# Altium schematic sheet LSM6DSOX_Ctrl.SchDoc
size A4
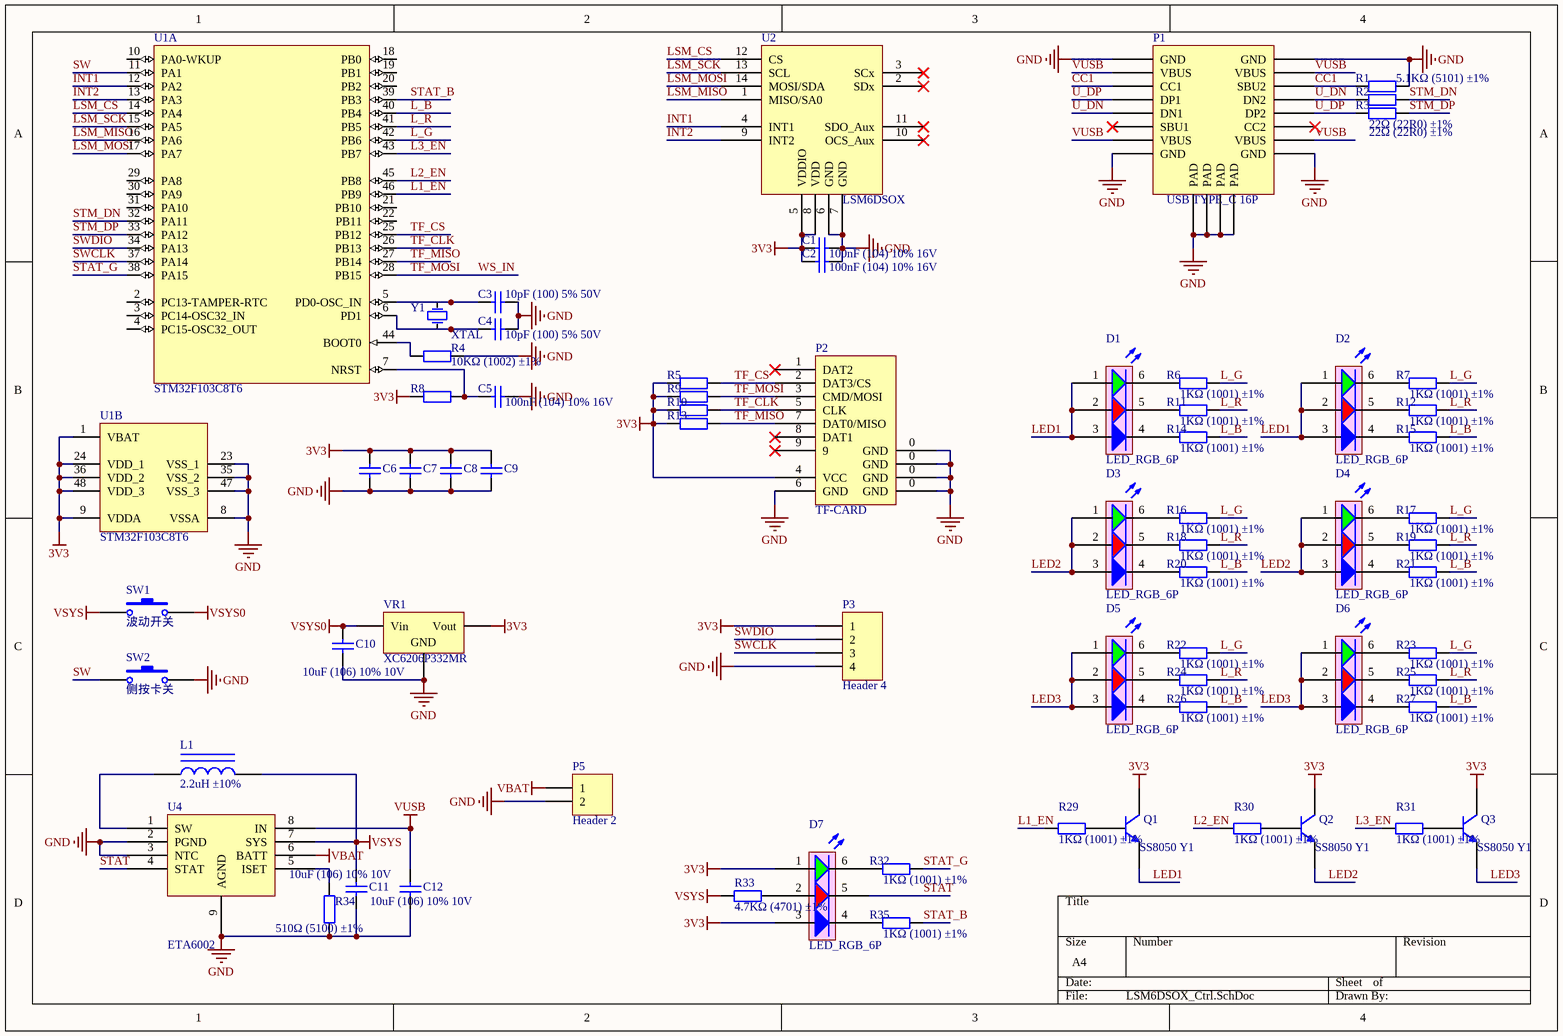
[diagram p0: LSM6DSOX_Ctrl.SchDoc]

## Parts
C1  100nF (104) 10% 16V  [0402_C]
C2  100nF (104) 10% 16V  [0402_C]
C3  10pF (100) 5% 50V  [0402_C]
C4  10pF (100) 5% 50V  [0402_C]
C5  100nF (104) 10% 16V  [0402_C]
C6  100nF (104) 10% 16V  [0402_C]  (value not drawn)
C7  100nF (104) 10% 16V  [0402_C]  (value not drawn)
C8  100nF (104) 10% 16V  [0402_C]  (value not drawn)
C9  100nF (104) 10% 16V  [0402_C]  (value not drawn)
C10  10uF (106) 10% 10V  [0603_C]
C11  10uF (106) 10% 10V  [0603_C]
C12  10uF (106) 10% 10V  [0603_C]
D1  LED_RGB_6P  [LED_6P]
D2  LED_RGB_6P  [LED_6P]
D3  LED_RGB_6P  [LED_6P]
D4  LED_RGB_6P  [LED_6P]
D5  LED_RGB_6P  [LED_6P]
D6  LED_RGB_6P  [LED_6P]
D7  LED_RGB_6P  [LED_6P]
L1  2.2uH ±10%  [0805_L]
P1  USB TYPE_C 16P  [USB-Typec 16P母]
P2  TF-CARD  [TF-1.7H]
P3  Header 4  [HDR1X4]
P5  Header 2  [HDR1X2]
Q1  SS8050 Y1  [SOT-23(SOT-23-3)]
Q2  SS8050 Y1  [SOT-23(SOT-23-3)]
Q3  SS8050 Y1  [SOT-23(SOT-23-3)]
R1  5.1KΩ (5101) ±1%  [0402_R]
R2  22Ω (22R0) ±1%  [0402_R]
R3  22Ω (22R0) ±1%  [0402_R]
R4  10KΩ (1002) ±1%  [0402_R]
R5  10KΩ (1002) ±1%  [0402_R]  (value not drawn)
R6  1KΩ (1001) ±1%  [0402_R]
R7  1KΩ (1001) ±1%  [0402_R]
R8  10KΩ (1002) ±1%  [0402_R]  (value not drawn)
R9  10KΩ (1002) ±1%  [0402_R]  (value not drawn)
R10  10KΩ (1002) ±1%  [0402_R]  (value not drawn)
R11  1KΩ (1001) ±1%  [0402_R]
R12  1KΩ (1001) ±1%  [0402_R]
R13  10KΩ (1002) ±1%  [0402_R]  (value not drawn)
R14  1KΩ (1001) ±1%  [0402_R]
R15  1KΩ (1001) ±1%  [0402_R]
R16  1KΩ (1001) ±1%  [0402_R]
R17  1KΩ (1001) ±1%  [0402_R]
R18  1KΩ (1001) ±1%  [0402_R]
R19  1KΩ (1001) ±1%  [0402_R]
R20  1KΩ (1001) ±1%  [0402_R]
R21  1KΩ (1001) ±1%  [0402_R]
R22  1KΩ (1001) ±1%  [0402_R]
R23  1KΩ (1001) ±1%  [0402_R]
R24  1KΩ (1001) ±1%  [0402_R]
R25  1KΩ (1001) ±1%  [0402_R]
R26  1KΩ (1001) ±1%  [0402_R]
R27  1KΩ (1001) ±1%  [0402_R]
R29  1KΩ (1001) ±1%  [0402_R]
R30  1KΩ (1001) ±1%  [0402_R]
R31  1KΩ (1001) ±1%  [0402_R]
R32  1KΩ (1001) ±1%  [0402_R]
R33  4.7KΩ (4701) ±1%  [0402_R]
R34  510Ω (5100) ±1%  [0603_R]
R35  1KΩ (1001) ±1%  [0402_R]
SW1  波动开关  [SW-SMD_3P-L6.6-W2.7-P1.50]
SW2  侧按卡关  [SW_PTCFG]
U1  STM32F103C8T6  [LQFP-48_7x7x05P]  (parts A,B of 2)
U2  LSM6DSOX  [LGA-14L]
U4  ETA6002  [SOIC-8P]
VR1  XC6206P332MR  [SOT-23-3L]
Y1  XTAL  [MURATA]

## Nets
3V3: C1.1 C2.1 C6.2 C7.2 C8.2 C9.2 D7.1(A_G) D7.3(A_R) P2.4(VCC) P3.1 Q1.3(C) Q2.3(C) Q3.3(C) R5.1 R8.1 R9.1 R10.1 R13.1 U1.1(VBAT) U1.9(VDDA) U1.24(VDD_1) U1.36(VDD_2) U1.48(VDD_3) U2.5(VDDIO) U2.8(VDD) VR1.2(Vout)
GND: C1.2 C2.2 C3.2 C4.1 C5.2 C6.1 C7.1 C8.1 C9.1 C10.1 C11.1 C12.1 P1.1(PAD) P1.2(PAD) P1.3(PAD) P1.4(PAD) P1.A1(GND) P1.A12(GND) P1.B1(GND) P1.B12(GND) P2.0(GND) P2.6(GND) P3.4 P5.2 R1.2 R4.2 R34.1 SW2.2 U1.8(VSSA) U1.23(VSS_1) U1.35(VSS_2) U1.47(VSS_3) U2.6(GND) U2.7(GND) U4.2(PGND) U4.3(NTC) U4.9(AGND) VR1.1(GND)
VBAT: P5.1 U4.6(BATT)
VSYS: C11.2 L1.2 R33.1 SW1.1 U4.7(SYS)
VSYS0: C10.2 SW1.2 VR1.3(Vin)
VUSB: C12.2 P1.A4(VBUS) P1.A9(VBUS) P1.B4(VBUS) P1.B9(VBUS) U4.8(IN)
CC1: P1.A5(CC1) P1.B8(SBU2) R1.1
INT1: U1.12(PA2) U2.4(INT1)
INT2: U1.13(PA3) U2.9(INT2)
L1_EN: R29.1 U1.46(PB9)
L2_EN: R30.1 U1.45(PB8)
L3_EN: R31.1 U1.43(PB7)
L_B: R14.2 R15.2 R20.2 R21.2 R26.2 R27.2 U1.40(PB4)
L_G: R6.2 R7.2 R16.2 R17.2 R22.2 R23.2 U1.42(PB6)
L_R: R11.2 R12.2 R18.2 R19.2 R24.2 R25.2 U1.41(PB5)
LED1: D1.1(A_G) D1.2(A_B) D1.3(A_R) D2.1(A_G) D2.2(A_B) D2.3(A_R) Q1.2(E)
LED2: D3.1(A_G) D3.2(A_B) D3.3(A_R) D4.1(A_G) D4.2(A_B) D4.3(A_R) Q2.2(E)
LED3: D5.1(A_G) D5.2(A_B) D5.3(A_R) D6.1(A_G) D6.2(A_B) D6.3(A_R) Q3.2(E)
LSM_CS: U1.14(PA4) U2.12(CS)
LSM_MISO: U1.16(PA6) U2.1(MISO/SA0)
LSM_MOSI: U1.17(PA7) U2.14(MOSI/SDA)
LSM_SCK: U1.15(PA5) U2.13(SCL)
STAT: D7.5(B) U4.4(STAT)
STAT_B: R35.2 U1.39(PB3)
STAT_G: R32.2 U1.38(PA15)
STM_DN: R2.2 U1.32(PA11)
STM_DP: R3.2 U1.33(PA12)
SW: SW2.1 U1.11(PA1)
SWCLK: P3.3 U1.37(PA14)
SWDIO: P3.2 U1.34(PA13)
TF_CLK: P2.5(CLK) R10.2 U1.26(PB13)
TF_CS: P2.2(DAT3/CS) R5.2 U1.25(PB12)
TF_MISO: P2.7(DAT0/MISO) R13.2 U1.27(PB14)
TF_MOSI: P2.3(CMD/MOSI) R9.2 U1.28(PB15)  [also labelled WS_IN]
U_DN: P1.A7(DN1) P1.B7(DN2) R2.1
U_DP: P1.A6(DP1) P1.B6(DP2) R3.1
NetC3_1: C3.1 U1.5(PD0-OSC_IN) Y1.2(OSC2)
NetC4_2: C4.2 U1.6(PD1) Y1.1(OSC1)
NetC5_1: C5.1 R8.2 U1.7(NRST)
NetD1_4: D1.4(R) R14.1
NetD1_5: D1.5(B) R11.1
NetD1_6: D1.6(G) R6.1
NetD2_4: D2.4(R) R15.1
NetD2_5: D2.5(B) R12.1
NetD2_6: D2.6(G) R7.1
NetD3_4: D3.4(R) R20.1
NetD3_5: D3.5(B) R18.1
NetD3_6: D3.6(G) R16.1
NetD4_4: D4.4(R) R21.1
NetD4_5: D4.5(B) R19.1
NetD4_6: D4.6(G) R17.1
NetD5_4: D5.4(R) R26.1
NetD5_5: D5.5(B) R24.1
NetD5_6: D5.6(G) R22.1
NetD6_4: D6.4(R) R27.1
NetD6_5: D6.5(B) R25.1
NetD6_6: D6.6(G) R23.1
NetD7_2: D7.2(A_B) R33.2
NetD7_4: D7.4(R) R35.1
NetD7_6: D7.6(G) R32.1
NetL1_1: L1.1 U4.1(SW)
NetQ1_1: Q1.1(B) R29.2
NetQ2_1: Q2.1(B) R30.2
NetQ3_1: Q3.1(B) R31.2
NetR4_1: R4.1 U1.44(BOOT0)
NetR34_2: R34.2 U4.5(ISET)

Not connected (* = marked no-connect by the designer): P1 A8(SBU1)* B5(CC2)*; P2 1(DAT2)* 8(DAT1)* 9*; U1 2(PC13-TAMPER-RTC) 3(PC14-OSC32_IN) 4(PC15-OSC32_OUT) 10(PA0-WKUP) 18(PB0) 19(PB1) 20(PB2) 21(PB10) 22(PB11) 29(PA8) 30(PA9) 31(PA10); U2 2(SDx)* 3(SCx)* 10(OCS_Aux)* 11(SDO_Aux)*

## Library data of the parts
C1 C2 C5-C9 = 0402 100nF (104) 10% 16V: 贴片电容; ComponentLink1Description: 供应商链接; ComponentLink1URL: http://www.szlcsc.com/product/details_1877.html; Package: 0402; Supplier: LC; SuppliersPartNumber: C1525
C3 C4 = 0402 10pF (100) 5% 50V: 贴片电容; ComponentLink1Description: 供应商链接; ComponentLink1URL: http://www.szlcsc.com/product/details_33914.html; Package: 0402; Supplier: LC; SuppliersPartNumber: C32949
C10-C12 = 0603 10uF (106) 10% 10V: 贴片电容; ComponentLink1Description: 供应商链接; ComponentLink1URL: http://www.szlcsc.com/product/details_20411.html; Package: 0603; Supplier: LC; SuppliersPartNumber: C19702
L1 = 0805 2.2uH 10%: 贴片电感; ComponentLink1Description: 供应商链接; ComponentLink1URL: http://www.szlcsc.com/product/details_1395.html; Package: 0805; Supplier: LC; SuppliersPartNumber: C1043
P2 = TF-CARD: TF卡槽
P3 = Header 4: Header, 4-Pin; LatestRevisionDate: 17-Jul-2002; LatestRevisionNote: Re-released for DXP Platform.; Publisher: Altium Limited
P5 = Header 2: Header, 2-Pin; LatestRevisionDate: 17-Jul-2002; LatestRevisionNote: Re-released for DXP Platform.; Publisher: Altium Limited
Q1-Q3 = SOT-23 SS8050 Y1: 三极管; ComponentLink1Description: 供应商链接; ComponentLink1URL: http://www.szlcsc.com/product/details_2507.html; Package: SOT-23; Supplier: LC; SuppliersPartNumber: C2150
R1 = 0402 5.1KΩ (5101) 1%: 贴片电阻; ComponentLink1Description: 供应商链接; ComponentLink1URL: http://www.szlcsc.com/product/details_26648.html; Package: 0402; Supplier: LC; SuppliersPartNumber: C25905
R2 R3 = 0402 22Ω (22R0) 1%: 贴片电阻; ComponentLink1Description: 供应商链接; ComponentLink1URL: http://www.szlcsc.com/product/details_25835.html; Package: 0402; Supplier: LC; SuppliersPartNumber: C25092
R4 R5 R8-R10 R13 = 0402 10KΩ (1002) 1%: 贴片电阻; ComponentLink1Description: 供应商链接; ComponentLink1URL: http://www.szlcsc.com/product/details_26487.html; Package: 0402; Supplier: LC; SuppliersPartNumber: C25744
R6 R7 R11 R12 R14-R27 R29-R32 R35 = 0402 1KΩ (1001) 1%: 贴片电阻; ComponentLink1Description: 供应商链接; ComponentLink1URL: http://www.szlcsc.com/product/details_12256.html; Package: 0402; Supplier: LC; SuppliersPartNumber: C11702
R33 = 0402 4.7KΩ (4701) 1%: 贴片电阻; ComponentLink1Description: 供应商链接; ComponentLink1URL: http://www.szlcsc.com/product/details_26643.html; Package: 0402; Supplier: LC; SuppliersPartNumber: C25900
R34 = 0603 510Ω (5100) 1%: 贴片电阻; ComponentLink1Description: 供应商链接; ComponentLink1URL: http://www.szlcsc.com/product/details_23920.html; Package: 0603; Supplier: LC; SuppliersPartNumber: C23193
SW1 = SW: 微动开关
SW2 = SW: 微动开关; pin to pad: 1>2 2>4
U1 = STM32F103C8T6: ARM; ComponentLink1Description: 供应商链接; ComponentLink1URL: http://www.szlcsc.com/product/details_9243.html; Package: LQFP-48_7x7x05P; Supplier: LC; SuppliersPartNumber: C8734
U4 = ETA6002: 3.7V充电芯片; pin to pad: 9>0
VR1 = SOT-23 XC6206P332MR: 低压差线性稳压(LDO); ComponentLink1Description: 供应商链接; ComponentLink1URL: http://www.szlcsc.com/product/details_5896.html; Package: SOT-23; Supplier: LC; SuppliersPartNumber: C5446
Y1 = XTAL: 无源晶振